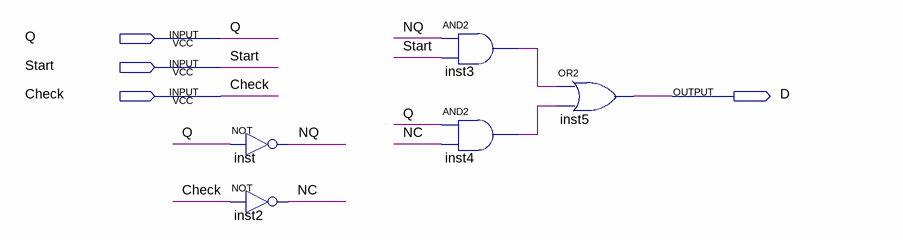
[diagram p0: schematic sheet]
// Quartus schematic NextState2.bdf as structural Verilog: 5 symbols, 4 pins
module NextState2 (
  input  Q,
  input  Start,
  input  Check,
  output D
);

  wire inst3_out, inst4_out, NC, NQ;

  not inst (NQ, Q);
  not inst2 (NC, Check);
  and inst3 (inst3_out, NQ, Start);
  and inst4 (inst4_out, Q, NC);
  or inst5 (D, inst3_out, inst4_out);
endmodule
